# EAGLE design SparkFun_Mini_FET_Shield (EAGLE 7.2.0)
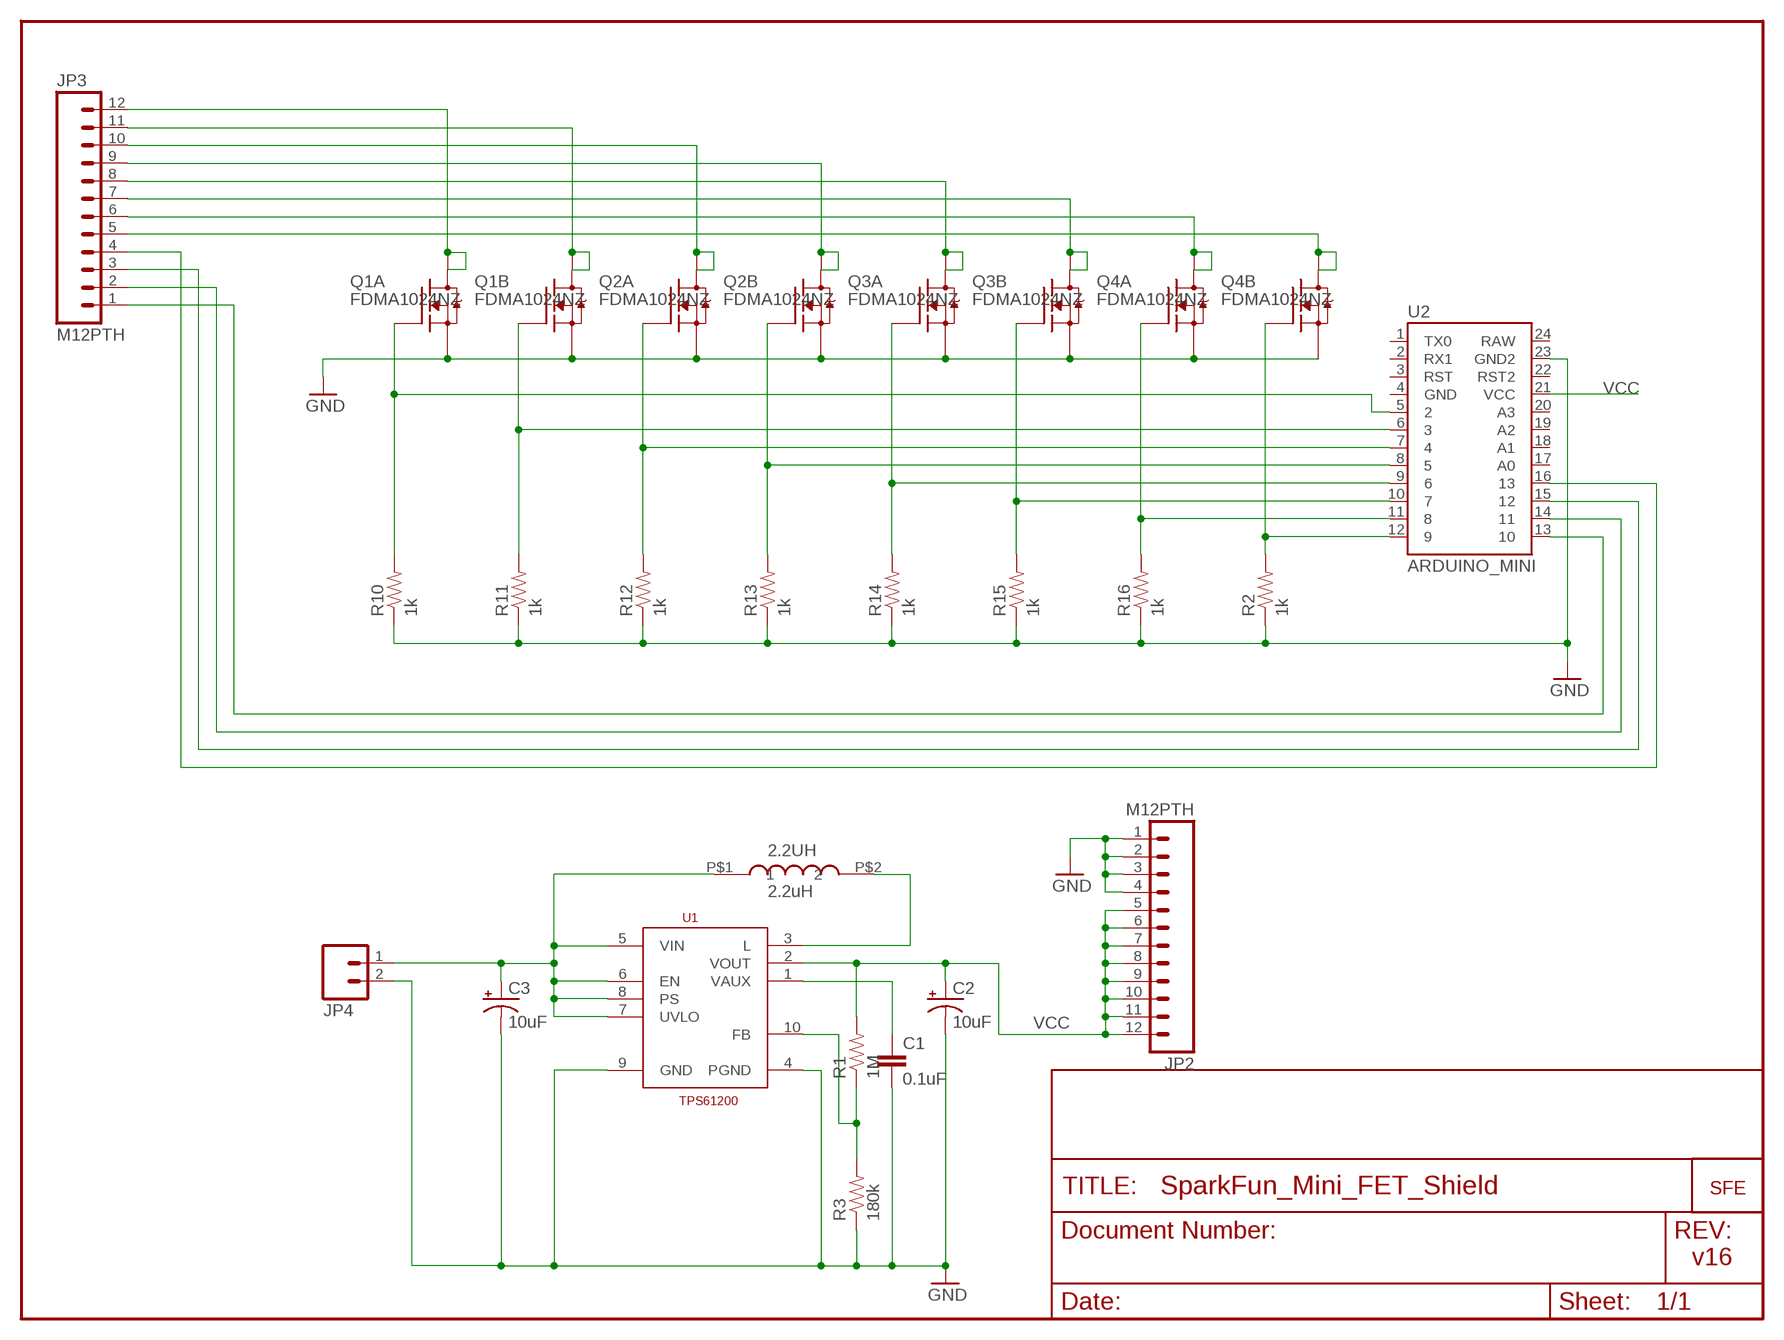
[diagram p0: schematic, sheet 1]

## Parts
2.2UH  2.2uH  VLF4012A  [VLF4012A]
C1  0.1uF  CAP0402-CAP  [0402-CAP]
C2  10uF  CAP_POL1206  [EIA3216]
C3  10uF  CAP_POL1206  [EIA3216]
JP2  M12PTH  [1X12]
JP3  M12PTH  [1X12]
JP4  M02PTH  [1X02]
JP5  LOGO-SFESK  [SFE-LOGO-FLAME]
Q1  FDMA1024NZ  [MICROFET_2X2]
Q2  FDMA1024NZ  [MICROFET_2X2]
Q3  FDMA1024NZ  [MICROFET_2X2]
Q4  FDMA1024NZ  [MICROFET_2X2]
R1  1M  RESISTOR0402-RES  [0402-RES]
R2  1k  RESISTOR0402-RES  [0402-RES]
R3  180k  RESISTOR0402-RES  [0402-RES]
R10  1k  RESISTOR0402-RES  [0402-RES]
R11  1k  RESISTOR0402-RES  [0402-RES]
R12  1k  RESISTOR0402-RES  [0402-RES]
R13  1k  RESISTOR0402-RES  [0402-RES]
R14  1k  RESISTOR0402-RES  [0402-RES]
R15  1k  RESISTOR0402-RES  [0402-RES]
R16  1k  RESISTOR0402-RES  [0402-RES]
U1  TPS61200  [DRC-S-PVSON-N10]
U2  ARDUINO_MINI  [ARDUINO_MINI]

## Nets
GND: C1.2 C2.C(-) C3.C(-) JP2.1 JP2.2 JP2.3 JP2.4 JP4.2 Q1.S1(A:S) Q1.S2(B:S) Q2.S1(A:S) Q2.S2(B:S) Q3.S1(A:S) Q3.S2(B:S) Q4.S1(A:S) Q4.S2(B:S) R2.1 R3.1 R10.1 R11.1 R12.1 R13.1 R14.1 R15.1 R16.1 U1.4(PGND) U1.9(GND) U2.23(GND2)
N$1: JP3.4 U2.16
N$2: R1.1 R3.2 U1.10(FB)
N$3: C1.1 U1.1(VAUX)
N$5: 2.2UH.P$2 U1.3(L)
N$7: Q1.G1(A:G) R10.2 U2.5
N$8: 2.2UH.P$1 C3.A(+) JP4.1 U1.5(VIN) U1.6(EN) U1.7(UVLO) U1.8(PS)
N$10: Q1.G2(B:G) R11.2 U2.6
N$11: Q2.G1(A:G) R12.2 U2.7
N$12: Q2.G2(B:G) R13.2 U2.8
N$13: Q3.G1(A:G) R14.2 U2.9
N$14: Q3.G2(B:G) R15.2 U2.10
N$15: Q4.G1(A:G) R16.2 U2.11
N$16: Q4.G2(B:G) R2.2 U2.12
N$17: JP3.12 Q1.D1(A:D) Q1.D1_2(A:D1)
N$18: JP3.11 Q1.D2(B:D) Q1.D2_2(B:D1)
N$19: JP3.10 Q2.D1(A:D) Q2.D1_2(A:D1)
N$20: JP3.9 Q2.D2(B:D) Q2.D2_2(B:D1)
N$21: JP3.8 Q3.D1(A:D) Q3.D1_2(A:D1)
N$22: JP3.7 Q3.D2(B:D) Q3.D2_2(B:D1)
N$23: JP3.6 Q4.D1(A:D) Q4.D1_2(A:D1)
N$24: JP3.5 Q4.D2(B:D) Q4.D2_2(B:D1)
N$25: JP3.3 U2.15
N$26: JP3.2 U2.14
N$27: JP3.1 U2.13
VCC: C2.A(+) JP2.5 JP2.6 JP2.7 JP2.8 JP2.9 JP2.10 JP2.11 JP2.12 R1.2 U1.2(VOUT) U2.21(VCC)
Unconnected: U2.1(TX0) U2.2(RX1) U2.3(RST) U2.4(GND) U2.17(A0) U2.18(A1) U2.19(A2) U2.20(A3) U2.22(RST2) U2.24(RAW)

## Notes on the sheet
- v16

## Library data of the parts
2.2UH = PEBBLE:VLF4012A
C1 = SparkFun:CAP: Capacitor Standard 0603 ceramic capacitor, and 0.1" leaded capacitor.
C2 C3 = SparkFun:CAP_POL: Capacitor Polarized These are standard SMD and PTH capacitors. Normally 10uF, 47uF, and 100uF in electrolytic and tantalum varieties. Always verify the external diameter of the through hole cap, it varies with capacity, voltage, and manufacturer. The EIA devices should be standard.
JP2 JP3 = SparkFun:M12: Header 12 Standard 12-pin 0.1" header. Use with straight break away headers (SKU : PRT-00116), right angle break away headers (PRT-00553), swiss pins (PRT-00743), machine pins (PRT-00117), and female headers (PRT-00115).
JP4 = SparkFun:M02: Header 2 Standard 2-pin 0.1" header. Use with straight break away headers (SKU : PRT-00116), right angle break away headers (PRT-00553), swiss pins (PRT-00743), machine pins (PRT-00117), and female headers (PRT-00115). Molex polarized connector foot print use with SKU : PRT-08233 with associated crimp pins and housings.
JP5 = SparkFun:LOGO-SFE: Spark Fun Electronics PCB Logo This is the standard Spark Fun Electronics PCB logo.
Q1-Q4 = PEBBLE:FDMA1024NZ: Dual N-Channel 30-V (D-S) MOSFET Source: http://www.vishay.com/docs/71053/71053.pdf
R1-R3 R10-R16 = SparkFun:RESISTOR: Resistor Basic schematic elements and footprints for 0603, 1206, and PTH resistors.
U1 = texas:TPS61200
U2 = SparkFun:ARDUINO_MINI

## Board
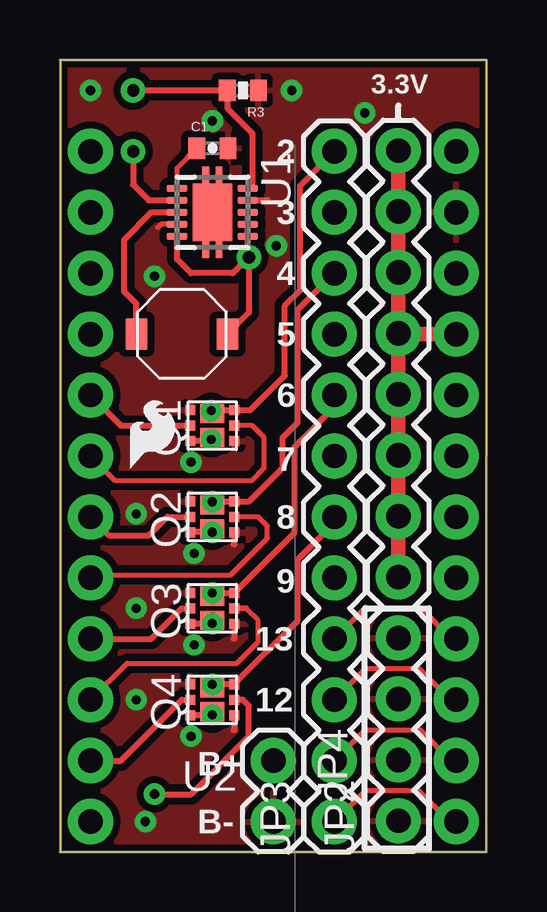
[diagram p1: board, top side]
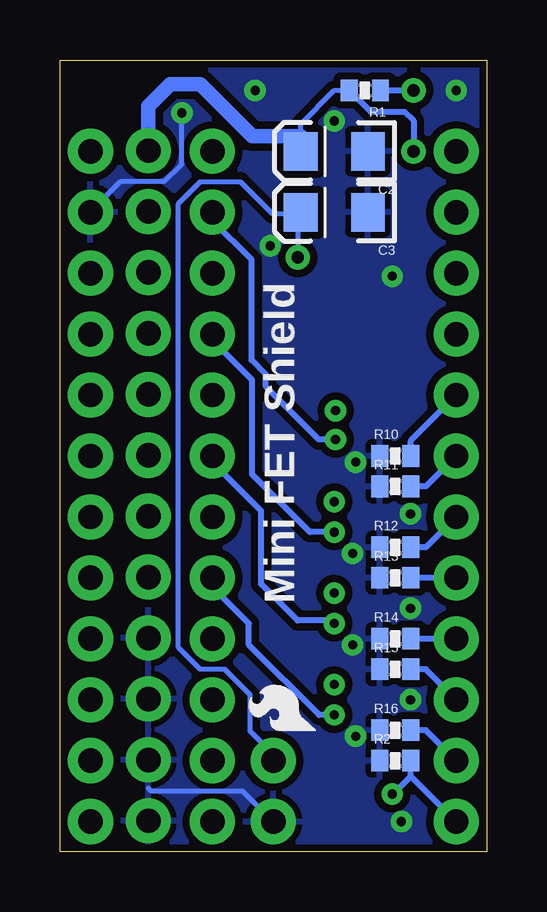
[diagram p2: board, bottom side, seen from below]

Size 17.78 x 33.02 mm. Coordinates in mm from the lower left corner, seen from the top.
Outline: 0,0 17.76,0 17.78,33.02 0,33.02 0,0
Copper layers (1*16): Top 0.035mm / dielectric 1.5mm / Bottom 0.035mm
Design rules "SparkFun": minimum track width 8mil, minimum drill 20mil, track to track 8mil, track to pad 8mil, pad to pad 8mil, via to via 8mil, smd to smd 8mil, copper to edge 8mil, drill to drill 8mil, minimum pad ring 12mil, minimum via ring 10mil, stop-mask expansion 4mil, vias tented up to drill 20mil, thermal gap 10mil

### Footprints (pad centres in the part's own frame; a part is rotated, then mirrored left to right if it is on the bottom)
VLF4012A = smd 0.9 x 1.3: P$1 -1.9,0; P$2 1.9,0
0402-CAP = smd 0.7 x 0.9: 1 -0.65,0; 2 0.65,0
EIA3216 = smd 1.4 x 1.6: A 1.4,0; C -1.4,0
1X12 = drill 1.016 pad 1.88: 1 0,0; 2 2.54,0; 3 5.08,0; 4 7.62,0; 5 10.16,0; 6 12.7,0; 7 15.24,0; 8 17.78,0; 9 20.32,0; 10 22.86,0; 11 25.4,0; 12 27.94,0
1X02 = drill 1.016 pad 1.88: 1 0,0; 2 2.54,0
MICROFET_2X2 = smd 0.8 x 1: D1 0.5,0; D2 -0.5,0 | smd 0.42 x 0.42: D1_2 0.65,-0.915; D2_2 -0.65,0.915; G1 0,0.915; G2 0,-0.915; S1 0.65,0.915; S2 -0.65,-0.915
0402-RES = smd 0.7 x 0.9: 1 -0.65,0; 2 0.65,0
DRC-S-PVSON-N10 = smd 0.28 x 0.85: 1 -1,-1.475; 2 -0.5,-1.475; 3 0,-1.475; 4 0.5,-1.475; 5 1,-1.475; 6 1,1.475; 7 0.5,1.475; 8 0,1.475; 9 -0.5,1.475; 10 -1,1.475 | smd 2.4 x 1.65: TH 0,0 | smd 3.8 x 0.28: TH@1 0,0.275; TH@2 0,-0.275
ARDUINO_MINI = drill 1.016 pad 1.88: 1 -7.62,12.7; 2 -7.62,10.16; 3 -7.62,7.62; 4 -7.62,5.08; 5 -7.62,2.54; 6 -7.62,0; 7 -7.62,-2.54; 8 -7.62,-5.08; 9 -7.62,-7.62; 10 -7.62,-10.16; 11 -7.62,-12.7; 12 -7.62,-15.24; 13 7.62,-15.24; 14 7.62,-12.7; 15 7.62,-10.16; 16 7.62,-7.62; 17 7.62,-5.08; 18 7.62,-2.54; 19 7.62,0; 20 7.62,2.54; 21 7.62,5.08; 22 7.62,7.62; 23 7.62,10.16; 24 7.62,12.7

### Placement (x,y rotation side)
2.2UH  5.08,21.59 180 top
C1  6.35,29.34 0 top
C2  6.35,29.21 180 bottom
C3  6.35,26.67 180 bottom
JP1  LOGO-SFESK  [SFE-LOGO-FLAME]  2.92,16 0 top
JP2  14.1,1.3 90 top
JP3  11.43,1.27 90 top
JP4  8.89,3.81 270 top
JP5  7.11,5.08 90 bottom
Q1  6.35,17.78 90 top
Q2  6.35,13.97 90 top
Q3  6.35,10.16 90 top
Q4  6.35,6.35 90 top
R1  5.08,31.75 180 bottom
R2  3.81,3.81 0 bottom
R3  7.62,31.75 180 top
R10  3.81,16.51 0 bottom
R11  3.81,15.24 0 bottom
R12  3.81,12.7 0 bottom
R13  3.81,11.43 0 bottom
R14  3.81,8.89 0 bottom
R15  3.81,7.62 0 bottom
R16  3.81,5.08 0 bottom
U1  6.35,26.67 270 top
U2  8.89,16.51 0 top

### Tracks (layer width: path | path; a pad name or v marks a point on that pad's centre or on a via)
GND  (via drill 0.38)
  Top 0.203: U1.4 4.2,26.17 4.06,26.04
  Top 0.254: Q4.S2 7.26,5.08 7.24,5.08 | Q3.S2 7.26,8.89 7.24,8.89 | Q2.S2 7.26,12.83 7.24,12.83 | U1.9 8.64,27.18
  Bottom 0.203: JP4.2 10.16,2.54 13.97,2.54 14.1,2.67 | U2.23 15.24,27.96 13.44,27.96 12.7,28.68 12.7,30.68 12.72,30.71
  other vias: 3.56,1.27 3.17,14.1 3.17,10.16 3.17,6.35 5.46,16.26 5.59,12.45 5.59,8.64 1.27,31.75 5.46,4.83 3.94,24 9.65,31.75 6.35,30.48 9.02,25.27 12.7,30.81
  pour Top (isolate 0.305): 0,33.02 0,0 17.78,0 17.78,33.02
  pour Bottom (isolate 0.305): 0,33.02 0,0 17.78,0 17.78,33.02
N$1
  Top 0.203: U2.16 16.31,8.89 15,10.2 12.74,10.2 JP3.4
N$2  (via drill 0.51)
  Top 0.254: v3.05,31.75 R3.2 6.97,31 8,29.97 8,27.85 U1.10
  Bottom 0.254: R1.1 v3.05,31.75
N$3
  Top 0.203: U1.1 4.88,28.51 C1.1
N$5
  Top 0.254: U1.3 3.81,26.67 2.67,25.53 2.67,23.37 3.18,22.86 2.2UH.P$2
N$7
  Top 0.254: Q1.G1 2.54,17.78 U2.5
  Bottom 0.254: R10.2 3.16,17.16 U2.5
N$8  (via drill 0.51)
  Top 0.203: U1.8 7.82,26.26 U1.7 | v7.87,24.79 7.83,24.77
  Top 0.254: U1.5 4.88,24.72 5.46,24.13 7.19,24.13 7.83,24.77 U1.6 U1.7 | 2.2UH.P$1 7.87,22.48 v7.87,24.79
  Bottom 0.203: v7.87,24.79 7.87,26.57 7.77,26.67 C3.A 7.92,26.62 8.94,26.62 10.26,27.94 11.94,27.94 12.85,27.03 12.85,8.53 11.94,7.62 10.92,7.62 9.86,6.55 9.86,5.03 8.89,4.06 JP4.1
N$10
  Top 0.203: Q1.G2 8,17.78 8.51,17.27 8.51,16 8,15.49 2.29,15.49 U2.6
  Bottom 0.254: R11.2 2.54,15.24 U2.6
N$11
  Top 0.254: Q2.G1 4.47,13.97 3.7,13.2 2.04,13.2 U2.7
  Bottom 0.254: R12.2 2.54,12.7 U2.7
N$12
  Top 0.203: Q2.G2 8.26,13.97 8.64,13.59 8.64,13.08 7.11,11.56 1.4,11.56 U2.8
  Bottom 0.254: U2.8 R13.2
N$13
  Top 0.254: Q3.G1 5.08,10.16 3.81,8.89 U2.9
  Bottom 0.254: U2.9 R14.2
N$14
  Top 0.203: 7.75,10.16 8.26,9.65 8.26,8.76 7.37,7.87 2.79,7.87 U2.10
  Top 0.254: 7.75,10.16 Q3.G2
  Bottom 0.254: R15.2 2.54,7.62 U2.10
N$15
  Top 0.254: Q4.G1 5.08,6.35 2.54,3.81 U2.11
  Bottom 0.254: R16.2 2.54,5.08 U2.11
N$16  (via drill 0.38)
  Top 0.254: Q4.G2 7.62,6.35 7.87,6.1 7.87,4.83 5.46,2.41 v3.94,2.41
  Bottom 0.254: 3.16,3.16 R2.2 | U2.12 3.16,3.16 | 3.16,3.16 3.91,2.41 v3.94,2.41
N$17  (via drill 0.38)
  Top 0.254: v6.3,18.4 6.35,18.35 Q1.D1 6.5,18.43 Q1.D1_2 7.93,18.43 9.37,19.87 9.37,22.77 10,23.4 10,27.78 JP3.12
N$18  (via drill 0.38)
  Top 0.254: Q1.D2_2 6.23,17.13 v6.3,17.2 6.3,17.23 Q1.D2
  Bottom 0.254: JP3.11 11.43,26.33 9.8,24.7 9.8,20.5 9.2,19.9 9.2,19.4 7,17.2 6.43,17.2 Q1.D2 6.35,17.25 v6.3,17.2
N$19  (via drill 0.38)
  Top 0.254: JP3.10 9.91,22.61 9.91,17.91 9.27,17.27 9.27,16 7.89,14.62 Q2.D1_2 7.25,14.61 v6.35,14.61 Q2.D1
N$20  (via drill 0.38)
  Top 0.254: Q2.D2_2 5.45,13.34 v6.35,13.34 Q2.D2
  Bottom 0.254: JP3.9 11.43,21.34 9.78,19.68 9.78,15.75 7.37,13.34 v6.35,13.34
N$21  (via drill 0.38)
  Top 0.254: v6.35,10.79 Q3.D1 6.5,10.81 Q3.D1_2 9.78,13.32 9.78,16.89 11.43,18.54 JP3.8
N$22  (via drill 0.38)
  Top 0.254: Q3.D2_2 6.33,9.51 v6.35,9.53 Q3.D2
  Bottom 0.254: JP3.7 11.43,16.26 9.4,14.22 9.4,11.18 7.87,9.65 6.48,9.65 v6.35,9.53
N$23  (via drill 0.38)
  Top 0.254: JP3.6 10.92,13.46 10.92,13.21 9.91,12.19 9.91,9.64 Q4.D1_2 6.37,7 v6.35,6.99 Q4.D1
N$24  (via drill 0.38)
  Top 0.254: Q4.D2_2 6.33,5.7 v6.35,5.71 Q4.D2
  Bottom 0.254: v6.35,5.71 6.99,5.71 9.91,8.64 9.91,9.53 11.43,11.05 JP3.5
N$25
  Top 0.203: U2.15 16.25,6.35 14.95,7.65 12.73,7.65 JP3.3
N$26
  Top 0.203: U2.14 16.29,3.81 15,5.1 12.72,5.1 JP3.2
N$27
  Top 0.203: U2.13 16.23,1.27 14.92,2.58 12.74,2.58 JP3.1
VCC  (via drill 0.51)
  Top 0.254: U1.2 3.69,27.17 3.05,27.81 v3.05,29.21
  Top 0.61: JP2.5 JP2.6 JP2.7 JP2.8 JP2.9 | JP2.9 JP2.10 JP2.11 JP2.12 | U2.21 14.13,21.59 JP2.9
  Bottom 0.203: 7.75,29.84 7.75,30.35 6.35,31.75 R1.2
  Bottom 0.254: 5.84,31.75 R1.2 4.84,30.86 3.43,30.86 3.05,30.48 v3.05,29.21 | 7.75,29.84 C2.A
  Bottom 0.61: 7.75,29.84 9.78,29.84 11.94,32 13.18,32 14.1,31.09 JP2.12

### Text on the board
tPlace: 3.3V | 2 | 3 | 4 | 5 | 6 | 7 | 8 | 9 | 13 | 12 | B+ | B-
bPlace: Mini FET Shield